# EAGLE schematic apu_standalone (EAGLE 6.5.0)

## Sheet 1 of 6: Interface
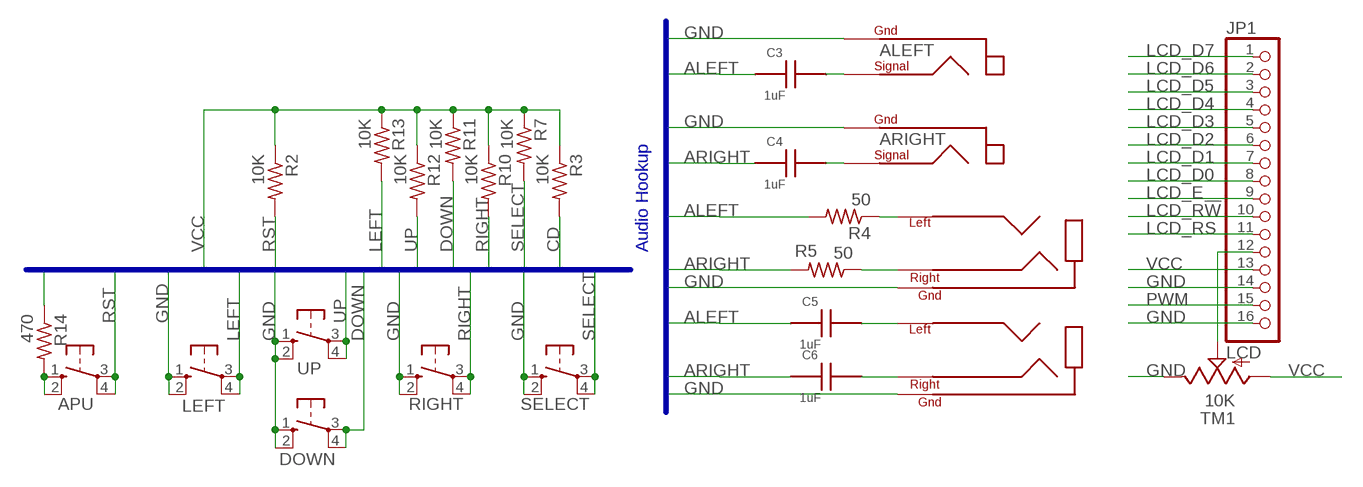
[diagram p0: schematic, sheet 1]

### Parts
APU  Reset  10-XX  [B3F-10XX]
C3  1uF  C0805  [C0805]
C4  1uF  C0805  [C0805]
C5  1uF  C0805  [C0805]
C6  1uF  C0805  [C0805]
DOWN  DOWN  10-XX  [B3F-10XX]
JP1  LCD  PINHD-1X16  [1X16]
LEFT  LEFT  10-XX  [B3F-10XX]
R2  10K  R-US_R0805  [R0805]
R3  10K  R-US_R0805  [R0805]
R4  50  R-US_R0805  [R0805]
R5  50  R-US_R0805  [R0805]
R7  10K  R-US_R0805  [R0805]
R10  10K  R-US_R0805  [R0805]
R11  10K  R-US_R0805  [R0805]
R12  10K  R-US_R0805  [R0805]
R13  10K  R-US_R0805  [R0805]
R14  470  R-US_R0805  [R0805]
RIGHT  RIGHT  10-XX  [B3F-10XX]
SELECT  SELECT  10-XX  [B3F-10XX]
TM1  10K  TRIM_US-CA6H  [CA6H]
U$2  HEADPHONE  [SJ1-3533N]
U$3  HEADPHONE  [SJ1-3533N]
U$4  RCA  [RCJ-01X]
U$5  RCA  [RCJ-01X]
UP  UP  10-XX  [B3F-10XX]

### Nets
ALEFT [audio]: C3.1 C5.1 R4.2 ; also sheet 2
ARIGHT [audio]: C4.1 C6.1 R5.2 ; also sheet 2
CD: R3.2 ; also sheet 3,5
DOWN: DOWN.3(P) DOWN.4(P1) R11.2 ; also sheet 3
GND [supply]: DOWN.1(S) DOWN.2(S1) JP1.14 JP1.16 LEFT.1(S) LEFT.2(S1) R14.1 RIGHT.1(S) RIGHT.2(S1) SELECT.1(S) SELECT.2(S1) TM1.E U$2.GND U$3.GND U$4.PGND1 U$4.PGND2 U$4.PGND3 U$5.PGND1 U$5.PGND2 U$5.PGND3 UP.1(S) UP.2(S1) ; also sheet 2,3,4,5,6
LCD_D0: JP1.8 ; also sheet 3
LCD_D1: JP1.7 ; also sheet 3
LCD_D2: JP1.6 ; also sheet 3
LCD_D3: JP1.5 ; also sheet 3
LCD_D4: JP1.4 ; also sheet 3
LCD_D5: JP1.3 ; also sheet 3
LCD_D6: JP1.2 ; also sheet 3
LCD_D7: JP1.1 ; also sheet 3
LCD_E: JP1.9 ; also sheet 3
LCD_R!W: JP1.10 ; also sheet 3
LCD_RS: JP1.11 ; also sheet 3
LEFT: LEFT.3(P) LEFT.4(P1) R13.2 ; also sheet 3
N$2 [audio]: C3.2 U$4.PSIG
N$3 [audio]: C4.2 U$5.PSIG
N$4 [audio]: C5.2 U$3.LEFT
N$5: APU.1(S) APU.2(S1) R14.2
N$8 [audio]: C6.2 U$3.RIGHT
N$9 [audio]: R4.1 U$2.LEFT
N$10 [audio]: R5.1 U$2.RIGHT
N$13 [supply]: JP1.12 TM1.S
PWM: JP1.15 ; also sheet 3
RIGHT: R10.2 RIGHT.3(P) RIGHT.4(P1) ; also sheet 3
RST: APU.3(P) APU.4(P1) R2.2 ; also sheet 2,3
SELECT: R7.2 SELECT.3(P) SELECT.4(P1) ; also sheet 3
UP: R12.2 UP.3(P) UP.4(P1) ; also sheet 3
VCC [supply]: JP1.13 R2.1 R3.1 R7.1 R10.1 R11.1 R12.1 R13.1 TM1.A ; also sheet 2,3,4,5,6

### Buses
D[0..7],A[0..1],WR,RD,RST,ALEFT,ARIGHT,GND
RST,!WR,!RD,UP,DOWN,LEFT,RIGHT,SELECT,VCC,GND,CD

### Notes on the sheet
- Audio Hookup

## Sheet 2 of 6: APU
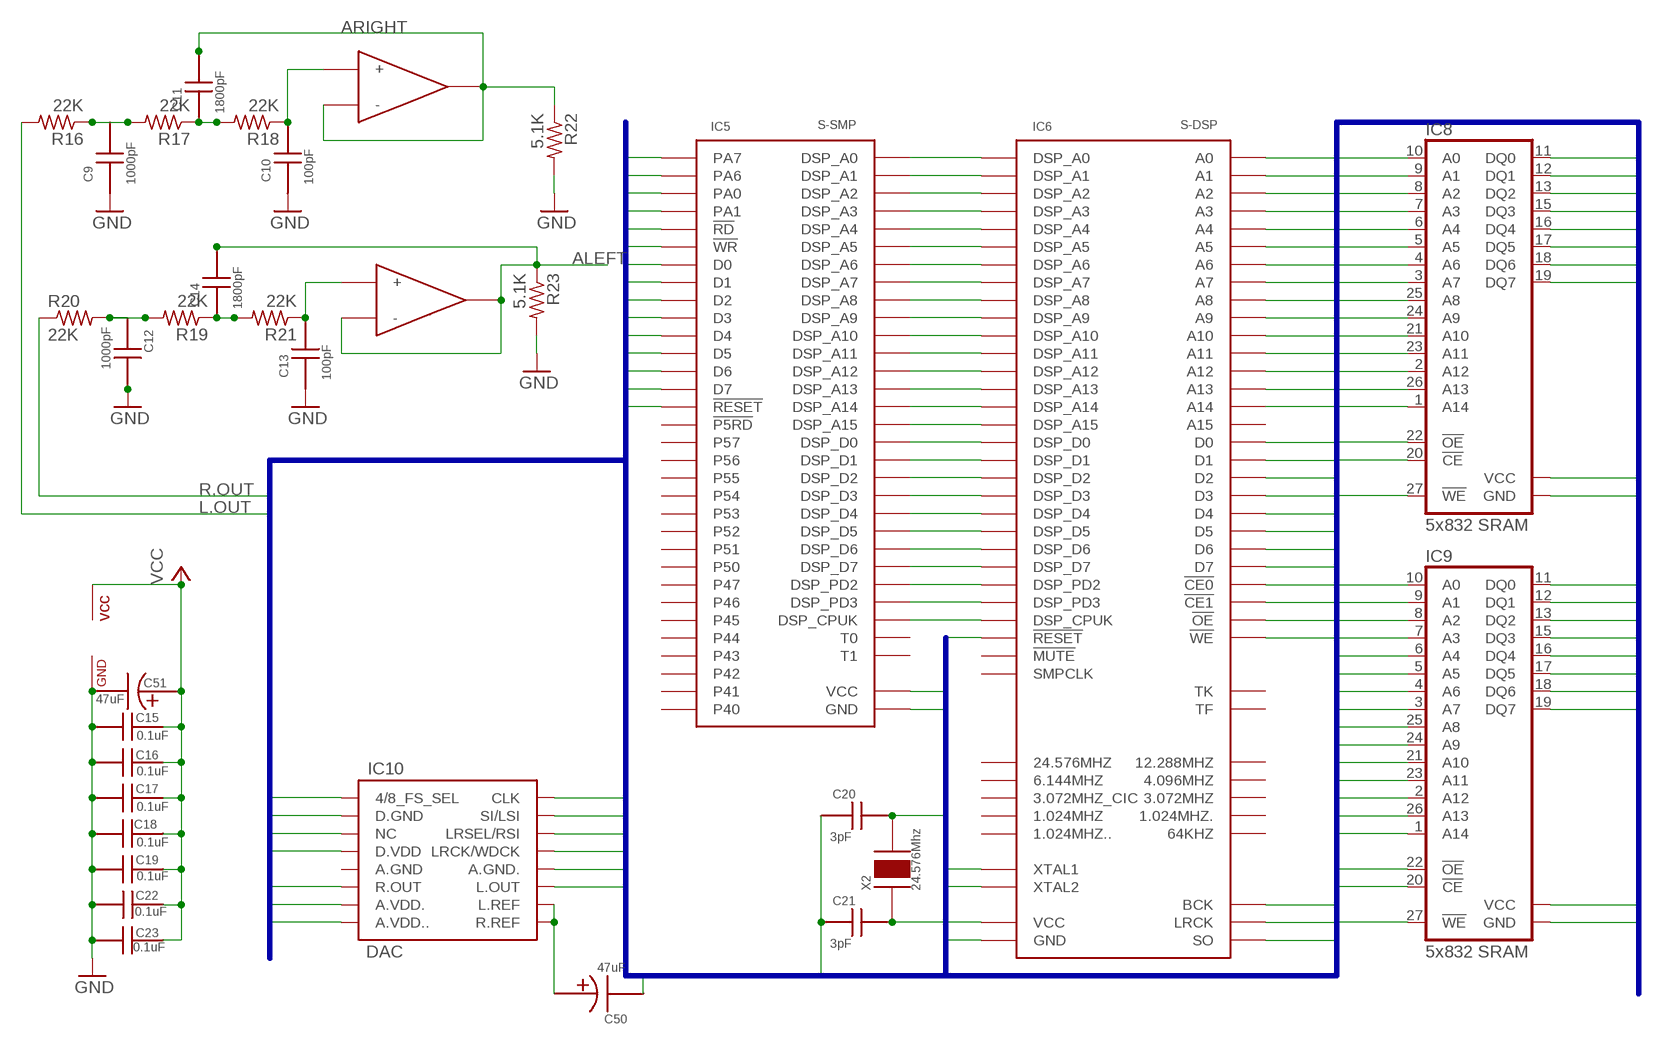
[diagram p1: schematic, sheet 2]

### Parts
C9  1000pF  C0805  [C0805]
C10  100pF  C0805  [C0805]
C11  1800pF  C0805  [C0805]
C12  1000pF  C0805  [C0805]
C13  100pF  C0805  [C0805]
C14  1800pF  C0805  [C0805]
C15  0.1uF  C0805  [C0805]
C16  0.1uF  C0805  [C0805]
C17  0.1uF  C0805  [C0805]
C18  0.1uF  C0805  [C0805]
C19  0.1uF  C0805  [C0805]
C20  3pF  C0805  [C0805]
C21  3pF  C0805  [C0805]
C22  0.1uF  C0805  [C0805]
C23  0.1uF  C0805  [C0805]
C50  47uF  CAPACITOR  [TT5D6]
C51  47uF  CAPACITOR  [TT5D6]
IC5  S-SMP  [QFP64_SOT319]
IC6  S-DSP  [QFP80_SOT318]
IC7  LM2904  [SO-08]
IC8  5x832 SRAM  SRAM  [SO28X]
IC9  5x832 SRAM  SRAM  [SO28X]
IC10  DAC  UPD6376  [SO16W]
R16  22K  R-US_R0805  [R0805]
R17  22K  R-US_R0805  [R0805]
R18  22K  R-US_R0805  [R0805]
R19  22K  R-US_R0805  [R0805]
R20  22K  R-US_R0805  [R0805]
R21  22K  R-US_R0805  [R0805]
R22  5.1K  R-US_R0805  [R0805]
R23  5.1K  R-US_R0805  [R0805]
X2  24.576Mhz  CRYSTAL  [QS]

### Nets
!CE0: IC6.28(!CE0) IC8.20(!CE)
!CE1: IC6.27(!CE1) IC9.20(!CE)
!OE: IC6.30(!OE) IC8.22(!OE) IC9.22(!OE)
!RD: IC5.46(!RD) ; also sheet 3,6
!WE: IC6.36(!WE) IC8.27(!WE) IC9.27(!WE)
!WR: IC5.47(!WR) ; also sheet 3,6
A10: IC5.49(PA0) ; also sheet 3,6
A11: IC5.48(PA1) ; also sheet 3,6
A15: IC5.51(PA7) ; also sheet 3,6
A18: IC6.9(A0) IC8.10(A0) IC9.10(A0)
A19: IC6.10(A1) IC8.9(A1) IC9.9(A1)
A20: IC6.11(A2) IC8.8(A2) IC9.8(A2)
A21: IC6.13(A3) IC8.7(A3) IC9.7(A3)
A22: IC6.14(A4) IC8.6(A4) IC9.6(A4)
A23: IC6.15(A5) IC8.5(A5) IC9.5(A5)
A24: IC6.16(A6) IC8.4(A6) IC9.4(A6)
A25: IC6.17(A7) IC8.3(A7) IC9.3(A7)
A26: IC6.34(A8) IC8.25(A8) IC9.25(A8)
A27: IC6.32(A9) IC8.24(A9) IC9.24(A9)
A28: IC6.29(A10) IC8.21(A10) IC9.21(A10)
A29: IC6.31(A11) IC8.23(A11) IC9.23(A11)
A30: IC6.18(A12) IC8.2(A12) IC9.2(A12)
A31: IC6.35(A13) IC8.26(A13) IC9.26(A13)
A32: IC6.19(A14) IC8.1(A14) IC9.1(A14)
A.REF [supply]: C50.+ IC10.9(R.REF) IC10.10(L.REF)
ALEFT [audio]: C14.2 IC7.6(-) IC7.7(OUT) R23.1 ; also sheet 1
ARIGHT [audio]: C11.2 IC7.1(OUT) IC7.2(-) R22.1 ; also sheet 1
BCK: IC6.42(BCK) IC10.16(CLK)
D0: IC5.45(D0) ; also sheet 3,6
D1: IC5.44(D1) ; also sheet 3,6
D2: IC5.43(D2) ; also sheet 3,6
D3: IC5.42(D3) ; also sheet 3,6
D4: IC5.41(D4) ; also sheet 3,6
D5: IC5.40(D5) ; also sheet 3,6
D6: IC5.39(D6) ; also sheet 3,6
D7: IC5.38(D7) ; also sheet 3,6
D8: IC6.8(D0) IC8.11(DQ0) IC9.11(DQ0)
D9: IC6.7(D1) IC8.12(DQ1) IC9.12(DQ1)
D10: IC6.6(D2) IC8.13(DQ2) IC9.13(DQ2)
D11: IC6.22(D3) IC8.15(DQ3) IC9.15(DQ3)
D12: IC6.23(D4) IC8.16(DQ4) IC9.16(DQ4)
D13: IC6.24(D5) IC8.17(DQ5) IC9.17(DQ5)
D14: IC6.25(D6) IC8.18(DQ6) IC9.18(DQ6)
D15: IC6.26(D7) IC8.19(DQ7) IC9.19(DQ7)
DSP_A0: IC5.5(DSP_A0) IC6.60(DSP_A0)
DSP_A1: IC5.4(DSP_A1) IC6.61(DSP_A1)
DSP_A2: IC5.3(DSP_A2) IC6.62(DSP_A2)
DSP_A3: IC5.2(DSP_A3) IC6.63(DSP_A3)
DSP_A4: IC5.1(DSP_A4) IC6.64(DSP_A4)
DSP_A5: IC5.64(DSP_A5) IC6.65(DSP_A5)
DSP_A6: IC5.63(DSP_A6) IC6.66(DSP_A6)
DSP_A7: IC5.62(DSP_A7) IC6.67(DSP_A7)
DSP_A8: IC5.61(DSP_A8) IC6.68(DSP_A8)
DSP_A9: IC5.60(DSP_A9) IC6.69(DSP_A9)
DSP_A10: IC5.59(DSP_A10) IC6.70(DSP_A10)
DSP_A11: IC5.56(DSP_A11) IC6.71(DSP_A11)
DSP_A12: IC5.55(DSP_A12) IC6.72(DSP_A12)
DSP_A13: IC5.54(DSP_A13) IC6.74(DSP_A13)
DSP_A14: IC5.53(DSP_A14) IC6.75(DSP_A14)
DSP_A15: IC5.52(DSP_A15) IC6.76(DSP_A15)
DSP_CPUK: IC5.16(DSP_CPUK) IC6.48(DSP_CPUK)
DSP_D0: IC5.13(DSP_D0) IC6.51(DSP_D0)
DSP_D1: IC5.12(DSP_D1) IC6.53(DSP_D1)
DSP_D2: IC5.11(DSP_D2) IC6.54(DSP_D2)
DSP_D3: IC5.10(DSP_D3) IC6.55(DSP_D3)
DSP_D4: IC5.9(DSP_D4) IC6.56(DSP_D4)
DSP_D5: IC5.8(DSP_D5) IC6.57(DSP_D5)
DSP_D6: IC5.7(DSP_D6) IC6.58(DSP_D6)
DSP_D7: IC5.6(DSP_D7) IC6.59(DSP_D7)
DSP_PD2: IC5.15(DSP_PD2) IC6.49(DSP_PD2)
DSP_PD3: IC5.14(DSP_PD3) IC6.50(DSP_PD3)
GND [supply]: C9.1 C10.1 C12.2 C13.1 C15.2 C16.2 C17.2 C18.2 C19.2 C20.1 C21.1 C22.1 C23.2 C50.- C51.- IC5.26(GND) IC5.58(GND) IC6.12(GND) IC6.52(GND) IC7.4(SUPPLY:GND) IC8.14(GND) IC9.14(GND) IC10.1(4/8_FS_SEL) IC10.2(D.GND) IC10.12(A.GND.) IC10.14(LRSEL/RSI) R22.2 R23.2 ; also sheet 1,3,4,5,6
L1 [audio]: C12.1 R19.2 R20.2
L2 [audio]: C14.1 R19.1 R21.2
L3 [audio]: C13.2 IC7.5(+) R21.1
L.OUT [audio]: IC10.11(L.OUT) R16.2
LRCK: IC6.43(LRCK) IC10.13(LRCK/WDCK)
R1 [audio]: C9.2 R16.1 R17.2
R2 [audio]: C11.1 R17.1 R18.2
R3 [audio]: C10.2 IC7.3(+) R18.1
R.OUT [audio]: IC10.6(R.OUT) R20.1
RST: IC5.37(!RESET) IC6.47(!RESET) ; also sheet 1,3
SO: IC6.44(SO) IC10.15(SI/LSI)
VCC [supply]: C15.1 C16.1 C17.1 C18.1 C19.1 C22.2 C23.1 C51.+ IC5.50(PA6) IC5.57(VCC) IC6.33(VCC) IC6.73(VCC) IC7.8(SUPPLY:VCC) IC8.28(VCC) IC9.28(VCC) IC10.3(NC) IC10.4(D.VDD) IC10.7(A.VDD.) IC10.8(A.VDD..) ; also sheet 1,3,4,5,6
XTAL1: C21.2 IC6.45(XTAL1) X2.1
XTAL2: C20.2 IC6.46(XTAL2) X2.2
Unconnected: IC5.17(!P5RD) IC5.18(P57) IC5.19(P56) IC5.20(P55) IC5.21(P54) IC5.22(P53) IC5.23(P52) IC5.24(P51) IC5.25(P50) IC5.27(P47) IC5.28(P46) IC5.29(P45) IC5.30(P44) IC5.31(P43) IC5.32(P42) IC5.33(P41) IC5.34(P40) IC5.35(T1) IC5.36(T0) IC6.1(4.096MHZ) IC6.2(3.072MHZ) IC6.3(1.024MHZ) IC6.4(1.024MHZ.) IC6.5(1.024MHZ..) IC6.20(A15) IC6.37(TF) IC6.38(TK) IC6.39(!MUTE) IC6.40(64KHZ) IC6.41(3.072MHZ_CIC) IC6.77(24.576MHZ) IC6.78(SMPCLK) IC6.79(12.288MHZ) IC6.80(6.144MHZ) IC10.5(A.GND)

### Buses
PA[0..7],PD[0..7],!RD,!WR,RST,!MUTE,SMPCLK,LEFT,RIGHT,GND,VCC,XTAL1,XTAL2,A[0..32],D[0..15],!CE0,!CE1,!OE,!WE,L.OUT,R.OUT,BCK,LRCK,SO,AVCC

## Sheet 3 of 6: ATMEGA2560
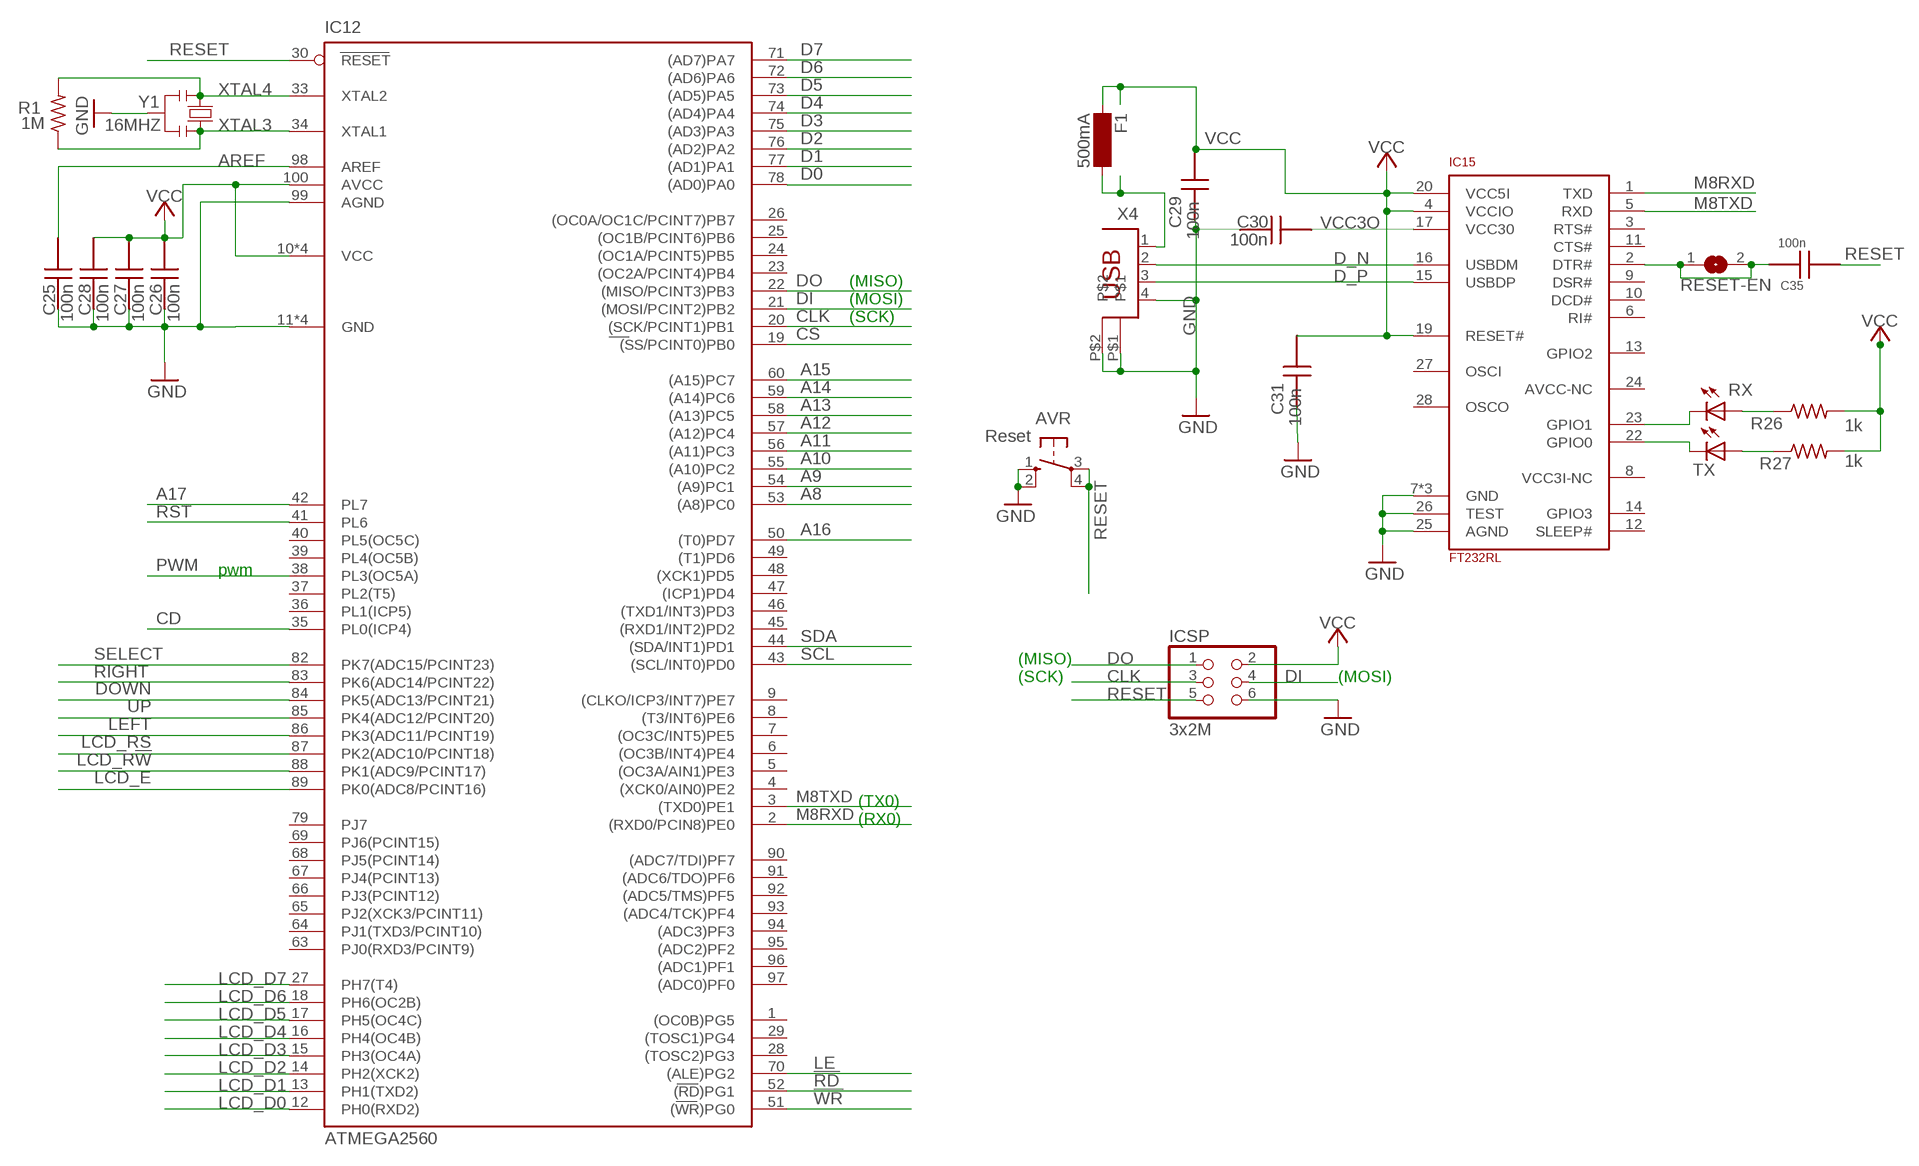
[diagram p2: schematic, sheet 3]

### Parts
AVR  Reset  10-XX  [B3F-10XX]
C25  100n  C0805  [C0805]
C26  100n  C0805  [C0805]
C27  100n  C0805  [C0805]
C28  100n  C0805  [C0805]
C29  100n  C0805  [C0805]
C30  100n  C0805  [C0805]
C31  100n  C0805  [C0805]
C35  100n  C0805  [C0805]
F1  500mA  SM-1206  [SM-1206]
IC12  ATMEGA2560  ATMEGA25602560-16AU  [TQFP100]
IC15  FT232RL  [SSOP28]
ICSP  3x2M  PINHD-2X3  [2X03]
R1  1M  R-US_R0805  [R0805]
R26  1k  R-US_R0805  [R0805]
R27  1k  R-US_R0805  [R0805]
RESET-EN  SJ  [SJ]
RX  LEDCHIP-LED0805  [CHIP-LED0805]
TX  LEDCHIP-LED0805  [CHIP-LED0805]
X4  PN61729  [PN61729]
Y1  16MHZ  RESONATORMU  [RESONATOR]

### Nets
!RD: IC12.52((RD)PG1) ; also sheet 2,6
!WR: IC12.51((WR)PG0) ; also sheet 2,6
A8: IC12.53((A8)PC0) ; also sheet 6
A9: IC12.54((A9)PC1) ; also sheet 6
A10: IC12.55((A10)PC2) ; also sheet 2,6
A11: IC12.56((A11)PC3) ; also sheet 2,6
A12: IC12.57((A12)PC4) ; also sheet 6
A13: IC12.58((A13)PC5) ; also sheet 6
A14: IC12.59((A14)PC6) ; also sheet 6
A15: IC12.60((A15)PC7) ; also sheet 2,6
A16: IC12.50((T0)PD7) ; also sheet 6
A17: IC12.42(PL7) ; also sheet 6
AREF: C25.1 IC12.98(AREF)
CD: IC12.35(PL0(ICP4)) ; also sheet 1,5
CLK: IC12.20((SCK/PCINT1)PB1) ICSP.3 ; also sheet 5
CS: IC12.19((SS/PCINT0)PB0) ; also sheet 5
D0: IC12.78((AD0)PA0) ; also sheet 2,6
D1: IC12.77((AD1)PA1) ; also sheet 2,6
D2: IC12.76((AD2)PA2) ; also sheet 2,6
D3: IC12.75((AD3)PA3) ; also sheet 2,6
D4: IC12.74((AD4)PA4) ; also sheet 2,6
D5: IC12.73((AD5)PA5) ; also sheet 2,6
D6: IC12.72((AD6)PA6) ; also sheet 2,6
D7: IC12.71((AD7)PA7) ; also sheet 2,6
D_N: IC15.16(USBDM) X4.2
D_P: IC15.15(USBDP) X4.3
DI: IC12.21((MOSI/PCINT2)PB2) ICSP.4 ; also sheet 5
DO: IC12.22((MISO/PCINT3)PB3) ICSP.1 ; also sheet 5
DOWN: IC12.84(PK5(ADC13/PCINT21)) ; also sheet 1
DTR: C35.1 IC15.2(DTR#) RESET-EN.1 RESET-EN.2
GND [supply]: AVR.1(S) AVR.2(S1) C25.2 C26.2 C27.2 C28.2 C29.2 C30.1 C31.2 IC12.11(GND) IC12.32(GND) IC12.62(GND) IC12.81(GND) IC12.99(AGND) IC15.7(GND) IC15.18(GND) IC15.21(GND) IC15.25(AGND) IC15.26(TEST) ICSP.6 X4.4 X4.P$1 X4.P$2 Y1.2 ; also sheet 1,2,4,5,6
LCD_D0: IC12.12(PH0(RXD2)) ; also sheet 1
LCD_D1: IC12.13(PH1(TXD2)) ; also sheet 1
LCD_D2: IC12.14(PH2(XCK2)) ; also sheet 1
LCD_D3: IC12.15(PH3(OC4A)) ; also sheet 1
LCD_D4: IC12.16(PH4(OC4B)) ; also sheet 1
LCD_D5: IC12.17(PH5(OC4C)) ; also sheet 1
LCD_D6: IC12.18(PH6(OC2B)) ; also sheet 1
LCD_D7: IC12.27(PH7(T4)) ; also sheet 1
LCD_E: IC12.89(PK0(ADC8/PCINT16)) ; also sheet 1
LCD_R!W: IC12.88(PK1(ADC9/PCINT17)) ; also sheet 1
LCD_RS: IC12.87(PK2(ADC10/PCINT18)) ; also sheet 1
LE: IC12.70((ALE)PG2) ; also sheet 6
LEFT: IC12.86(PK3(ADC11/PCINT19)) ; also sheet 1
M8RXD: IC12.2((RXD0/PCIN8)PE0) IC15.1(TXD)
M8TXD: IC12.3((TXD0)PE1) IC15.5(RXD)
N$1: IC15.23(GPIO1) RX.C
N$53: IC15.22(GPIO0) TX.C
N$54: R26.1 RX.A
N$55: R27.1 TX.A
N$60 [power usb]: F1.2 X4.1
PWM: IC12.38(PL3(OC5A)) ; also sheet 1
RESET: AVR.3(P) AVR.4(P1) C35.2 IC12.30(RESET) ICSP.5
RIGHT: IC12.83(PK6(ADC14/PCINT22)) ; also sheet 1
RST: IC12.41(PL6) ; also sheet 1,2
SCL: IC12.43((SCL/INT0)PD0) ; also sheet 4
SDA: IC12.44((SDA/INT1)PD1) ; also sheet 4
SELECT: IC12.82(PK7(ADC15/PCINT23)) ; also sheet 1
UP: IC12.85(PK4(ADC12/PCINT20)) ; also sheet 1
VCC [supply]: C26.1 C27.1 C28.1 C29.1 C31.1 F1.1 IC12.10(VCC) IC12.31(VCC) IC12.61(VCC) IC12.80(VCC) IC12.100(AVCC) IC15.4(VCCIO) IC15.19(RESET#) IC15.20(VCC5I) ICSP.2 R26.2 R27.2 ; also sheet 1,2,4,5,6
VCC3O [supply]: C30.2 IC15.17(VCC30)
XTAL3: IC12.34(XTAL1) R1.1 Y1.3
XTAL4: IC12.33(XTAL2) R1.2 Y1.1
Unconnected: IC12.1((OC0B)PG5) IC12.4((XCK0/AIN0)PE2) IC12.5((OC3A/AIN1)PE3) IC12.6((OC3B/INT4)PE4) IC12.7((OC3C/INT5)PE5) IC12.8((T3/INT6)PE6) IC12.9((CLKO/ICP3/INT7)PE7) IC12.23((OC2A/PCINT4)PB4) IC12.24((OC1A/PCINT5)PB5) IC12.25((OC1B/PCINT6)PB6) IC12.26((OC0A/OC1C/PCINT7)PB7) IC12.28((TOSC2)PG3) IC12.29((TOSC1)PG4) IC12.36(PL1(ICP5)) IC12.37(PL2(T5)) IC12.39(PL4(OC5B)) IC12.40(PL5(OC5C)) IC12.45((RXD1/INT2)PD2) IC12.46((TXD1/INT3)PD3) IC12.47((ICP1)PD4) IC12.48((XCK1)PD5) IC12.49((T1)PD6) IC12.63(PJ0(RXD3/PCINT9)) IC12.64(PJ1(TXD3/PCINT10)) IC12.65(PJ2(XCK3/PCINT11)) IC12.66(PJ3(PCINT12)) IC12.67(PJ4(PCINT13)) IC12.68(PJ5(PCINT14)) IC12.69(PJ6(PCINT15)) IC12.79(PJ7) IC12.90((ADC7/TDI)PF7) IC12.91((ADC6/TDO)PF6) IC12.92((ADC5/TMS)PF5) IC12.93((ADC4/TCK)PF4) IC12.94((ADC3)PF3) IC12.95((ADC2)PF2) IC12.96((ADC1)PF1) IC12.97((ADC0)PF0) IC15.3(RTS#) IC15.6(RI#) IC15.8(VCC3I-NC) IC15.9(DSR#) IC15.10(DCD#) IC15.11(CTS#) IC15.12(SLEEP#) IC15.13(GPIO2) IC15.14(GPIO3) IC15.24(AVCC-NC) IC15.27(OSCI) IC15.28(OSCO)

### Notes on the sheet
- (MISO)
- (MOSI)
- (SCK)
- pwm
- (MISO)
- (SCK) | (MOSI)
- (TX0)
- (RX0)

## Sheet 4 of 6: RTC
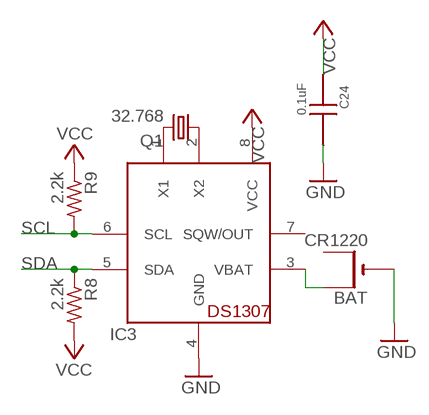
[diagram p3: schematic, sheet 4]

### Parts
BAT  CR1220  CR1220SMT  [CR1220-SMD]
C24  0.1uF  C0805  [C0805]
IC3  DS1307  DS1307SMT  [SO-08]
Q1  32.768  CRYTALSMD  [SMD]
R8  2.2k  R-US_R0805  [R0805]
R9  2.2k  R-US_R0805  [R0805]

### Nets
GND [supply]: BAT.- C24.2 IC3.4(GND) ; also sheet 1,2,3,5,6
N$15 [supply]: BAT.+$1(+) IC3.3(VBAT)
N$21 [supply]: IC3.1(X1) Q1.2
N$22 [supply]: IC3.2(X2) Q1.1
SCL: IC3.6(SCL) R9.2 ; also sheet 3
SDA: IC3.5(SDA) R8.1 ; also sheet 3
VCC [supply]: C24.1 IC3.8(VCC) R8.2 R9.1 ; also sheet 1,2,3,5,6
Unconnected: BAT.+$2 IC3.7(SQW/OUT)

## Sheet 5 of 6: Micro SD
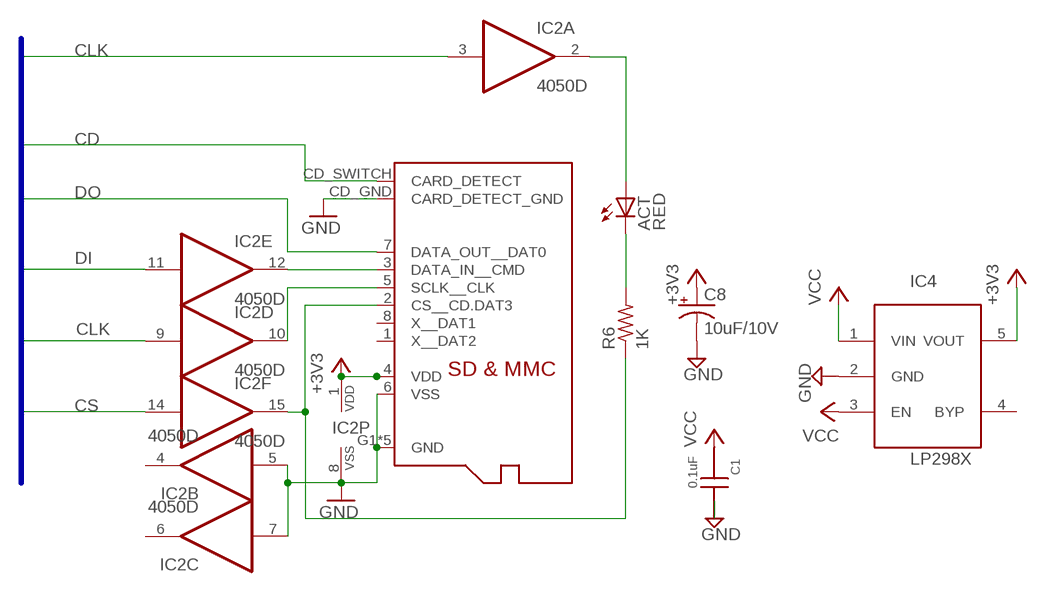
[diagram p4: schematic, sheet 5]

### Parts
ACT  RED  LEDCHIP-LED0805  [CHIP-LED0805]
C1  0.1uF  C0805  [C0805]
C8  10uF/10V  CPOL-USA/3216-18R  [A/3216-18R]
IC2  4050D  [SO16]
IC4  LP298XS  [SOT23-5L]
R6  1K  R-US_R0805  [R0805]
U$1  MICROSD-2  [MICROSD-3]

### Nets
+3V3 [supply]: C8.+ IC2.1(P:VDD) IC4.5(VOUT) U$1.4(VDD)
BUF_CLK: IC2.10(D:O) U$1.5(SCLK__CLK)
BUF_CS: IC2.15(F:O) R6.1 U$1.2(CS__CD.DAT3)
BUF_DI: IC2.12(E:O) U$1.3(DATA_IN__CMD)
BUF_LED: ACT.A IC2.2(A:O)
CD: U$1.CD_SWITCH(CARD_DETECT) ; also sheet 1,3
CLK: IC2.3(A:I) IC2.9(D:I) ; also sheet 3
CS: IC2.14(F:I) ; also sheet 3
DI: IC2.11(E:I) ; also sheet 3
DO: U$1.7(DATA_OUT__DAT0) ; also sheet 3
GND [supply]: C1.2 C8.- IC2.5(B:I) IC2.7(C:I) IC2.8(P:VSS) IC4.2(GND) U$1.6(VSS) U$1.CD_GND(CARD_DETECT_GND) U$1.G1(GND) U$1.G2(GND) U$1.G3(GND) U$1.G4(GND) U$1.G5(GND) ; also sheet 1,2,3,4,6
N$11: ACT.C R6.2
VCC [supply]: C1.1 IC4.1(VIN) IC4.3(EN) ; also sheet 1,2,3,4,6
Unconnected: IC2.4(B:O) IC2.6(C:O) IC4.4(BYP) U$1.1(X__DAT2) U$1.8(X__DAT1)

### Buses
D[0..7],A[0..18],VCC,GND,!RD,!WR,LE,CD,DO,DI,CLK,CS

## Sheet 6 of 6: SRAM
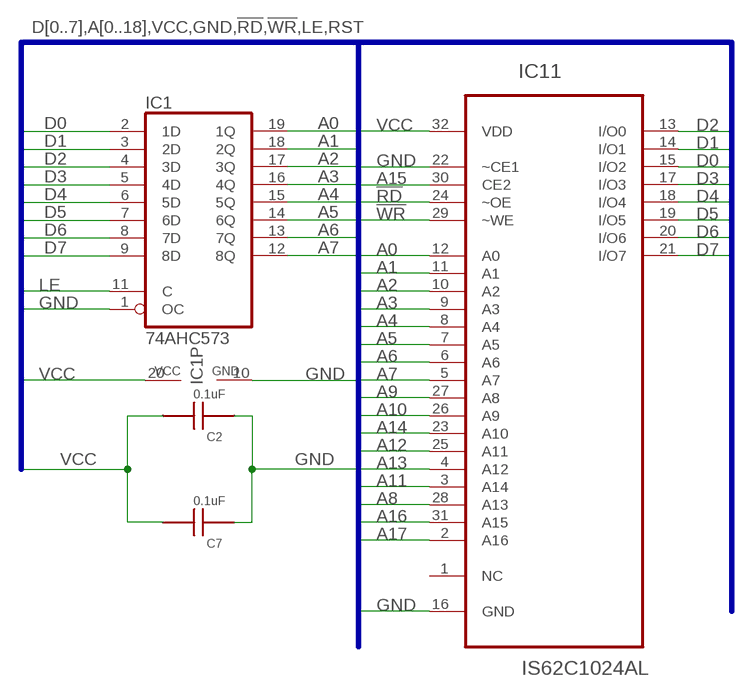
[diagram p5: schematic, sheet 6]

### Parts
C2  0.1uF  C0805  [C0805]
C7  0.1uF  C0805  [C0805]
IC1  74AHC573  74HCT573D  [SO20W]
IC11  IS62C1024AL  IS62C1024AL-35QLI  [SOIC127P1412X305-32N]

### Nets
!RD: IC11.24(~OE) ; also sheet 2,3
!WR: IC11.29(~WE) ; also sheet 2,3
A0: IC1.19(1Q) IC11.12(A0)
A1: IC1.18(2Q) IC11.11(A1)
A2: IC1.17(3Q) IC11.10(A2)
A3: IC1.16(4Q) IC11.9(A3)
A4: IC1.15(5Q) IC11.8(A4)
A5: IC1.14(6Q) IC11.7(A5)
A6: IC1.13(7Q) IC11.6(A6)
A7: IC1.12(8Q) IC11.5(A7)
A8: IC11.28(A13) ; also sheet 3
A9: IC11.27(A8) ; also sheet 3
A10: IC11.26(A9) ; also sheet 2,3
A11: IC11.3(A14) ; also sheet 2,3
A12: IC11.25(A11) ; also sheet 3
A13: IC11.4(A12) ; also sheet 3
A14: IC11.23(A10) ; also sheet 3
A15: IC11.30(CE2) ; also sheet 2,3
A16: IC11.31(A15) ; also sheet 3
A17: IC11.2(A16) ; also sheet 3
D0: IC1.2(1D) IC11.15(I/O2) ; also sheet 2,3
D1: IC1.3(2D) IC11.14(I/O1) ; also sheet 2,3
D2: IC1.4(3D) IC11.13(I/O0) ; also sheet 2,3
D3: IC1.5(4D) IC11.17(I/O3) ; also sheet 2,3
D4: IC1.6(5D) IC11.18(I/O4) ; also sheet 2,3
D5: IC1.7(6D) IC11.19(I/O5) ; also sheet 2,3
D6: IC1.8(7D) IC11.20(I/O6) ; also sheet 2,3
D7: IC1.9(8D) IC11.21(I/O7) ; also sheet 2,3
GND [supply]: C2.1 C7.1 IC1.1(OC) IC1.10(GND) IC11.16(GND) IC11.22(~CE1) ; also sheet 1,2,3,4,5
LE: IC1.11(C) ; also sheet 3
VCC [supply]: C2.2 C7.2 IC1.20(VCC) IC11.32(VDD) ; also sheet 1,2,3,4,5
Unconnected: IC11.1(NC)

### Buses
D[0..7],A[0..18],VCC,GND,!RD,!WR,LE,RST

## Library data of the parts
ACT RX TX = adafruit:LED: LED OSRAM: - CHIPLED LG R971, LG N971, LY N971, LG Q971, LY Q971, LO R971, LY R971 LH N974, LH R974 LS Q976, LO Q976, LY Q976 LO Q996 - Hyper CHIPLED LW Q18S LB Q993, LB Q99A, LB R99A - SideLED LS A670, LO A670, LY A670, LG A670, LP A670 LB A673, LV A673, LT A673, LW A673 LH A674 LY A675 LS A676, LA A676, LO A676, LY A676, LW A676 LS A679, LY A679, LG A679 - Hyper Micro SIDELED® LS Y876, LA Y876, LO Y876, LY Y876 LT Y87S - SmartLED LW L88C, LW L88S LB L89C, LB L89S, LG L890 LS L89K, LO L89K, LY L89K LS L896, LA L896, LO L896, LY L896 - TOPLED LS T670, LO T670, LY T670, LG T670, LP T670 LSG T670, LSP T670, LSY T670, LOP T670, LYG T670 LG T671, LOG T671, LSG T671 LB T673, LV T673, LT T673, LW T673 LH T674 LS T676, LA T676, LO T676, LY T676, LB T676, LH T676, LSB T676, LW T676 LB T67C, LV T67C, LT T67C, LS T67K, LO T67K, LY T67K, LW E67C LS E67B, LA E67B, LO E67B, LY E67B, LB E67C, LV E67C, LT E67C LW T67C LS T679, LY T679, LG T679 LS T770, LO T770, LY T770, LG T770, LP T770 LB T773, LV T773, LT T773, LW T773 LH T774 LS E675, LA E675, LY E675, LS T675 LS T776, LA T776, LO T776, LY T776, LB T776 LHGB T686 LT T68C, LB T68C - Hyper Mini TOPLED® LB M676 - Mini TOPLED Santana® LG M470 LS M47K, LO M47K, LY M47K Source: http://www.osram.convergy.de/
APU AVR DOWN LEFT RIGHT SELECT UP = switch-omron:10-XX: OMRON SWITCH
BAT = adafruit:CR1220: CR1216/CR1220/CR1225 12mm 3V lithium coin cell Great for battery packup. Both SMT and THM holders. Note the THM package has the ground pads on both sides of the PCB so that the masks are the same - this reduces the cost
C1-C7 C9-C31 C35 = apu_pcb:C0805
C8 = adafruit:CPOL-US: POLARIZED CAPACITOR, American symbol
C50 C51 = apu_pcb:CAPACITOR
F1 = inductor-neosid:SM-1206: INDUCTOR SMD chip inductor; OC_FARNELL: unknown; OC_NEWARK: unknown
IC1 = 74xx-eu:74*573: 8-bit D latch BUS DRIVER
IC2 = 40xx:4050: Hex non-inverting BUFFER
IC3 = adafruit:DS1307: DS1307 Real time clock (RTC) with battery backup ability. Talk to it via i2c
IC4 = adafruit:LP298X
IC5 = apu_pcb:S-SMP
IC6 = apu_pcb:S-DSP
IC7 = apu_pcb:LM2904
IC8 IC9 = apu_pcb:SRAM
IC10 = apu_pcb:UPD6376
IC11 = ISSI_By_element14_Batch_1:IS62C1024AL-35QLI: STATIC RAM; MPN: IS62C1024AL-35QLI; OC_FARNELL: 1869973; OC_NEWARK: 43M5399; PACKAGE: SOIC-32; SUPPLIER: INTEGRATED SILICON SOLUTION (ISSI)
IC12 = SmartPrj:ATMEGA2560: MICROCONTROLLER 64/128/256 Kbytes FLASH 4 Kbytes EEPROM 8 Kbytes SRAM 86 General Purpose I/O pins 12-channels16-bit PWM 4 x Serial USARTs 16-channels 10-bit A/D
IC15 = SmartPrj:FT232RL
ICSP = SmartPrj:PINHD-2X3: PIN HEADER
JP1 = pinhead:PINHD-1X16: PIN HEADER
Q1 = crystal:CRYTAL: CRYSTAL
R1-R14 R16-R23 R26 R27 = adafruit:R-US_: RESISTOR, American symbol
RESET-EN = jumper:SJ: SMD solder JUMPER
TM1 = pot:TRIM_US-: POTENTIOMETER
U$1 = adafruit:MICROSD-2
U$2 U$3 = caitsith2:HEADPHONE
U$4 U$5 = caitsith2:RCA
X2 = apu_pcb:CRYSTAL
X4 = SmartPrj:PN61729: BERG USB connector
Y1 = SmartPrj:RESONATOR

## Net classes
0 default: width 0.152 mm, clearance 0.152 mm
1 supply: width 0.203 mm, clearance 0.152 mm
2 audio: width 0.305 mm, clearance 0.152 mm
3 power usb: width 0.508 mm, drill 0.406 mm, clearance 0.203 mm